# Altium project mLRS_RX.PrjPcb
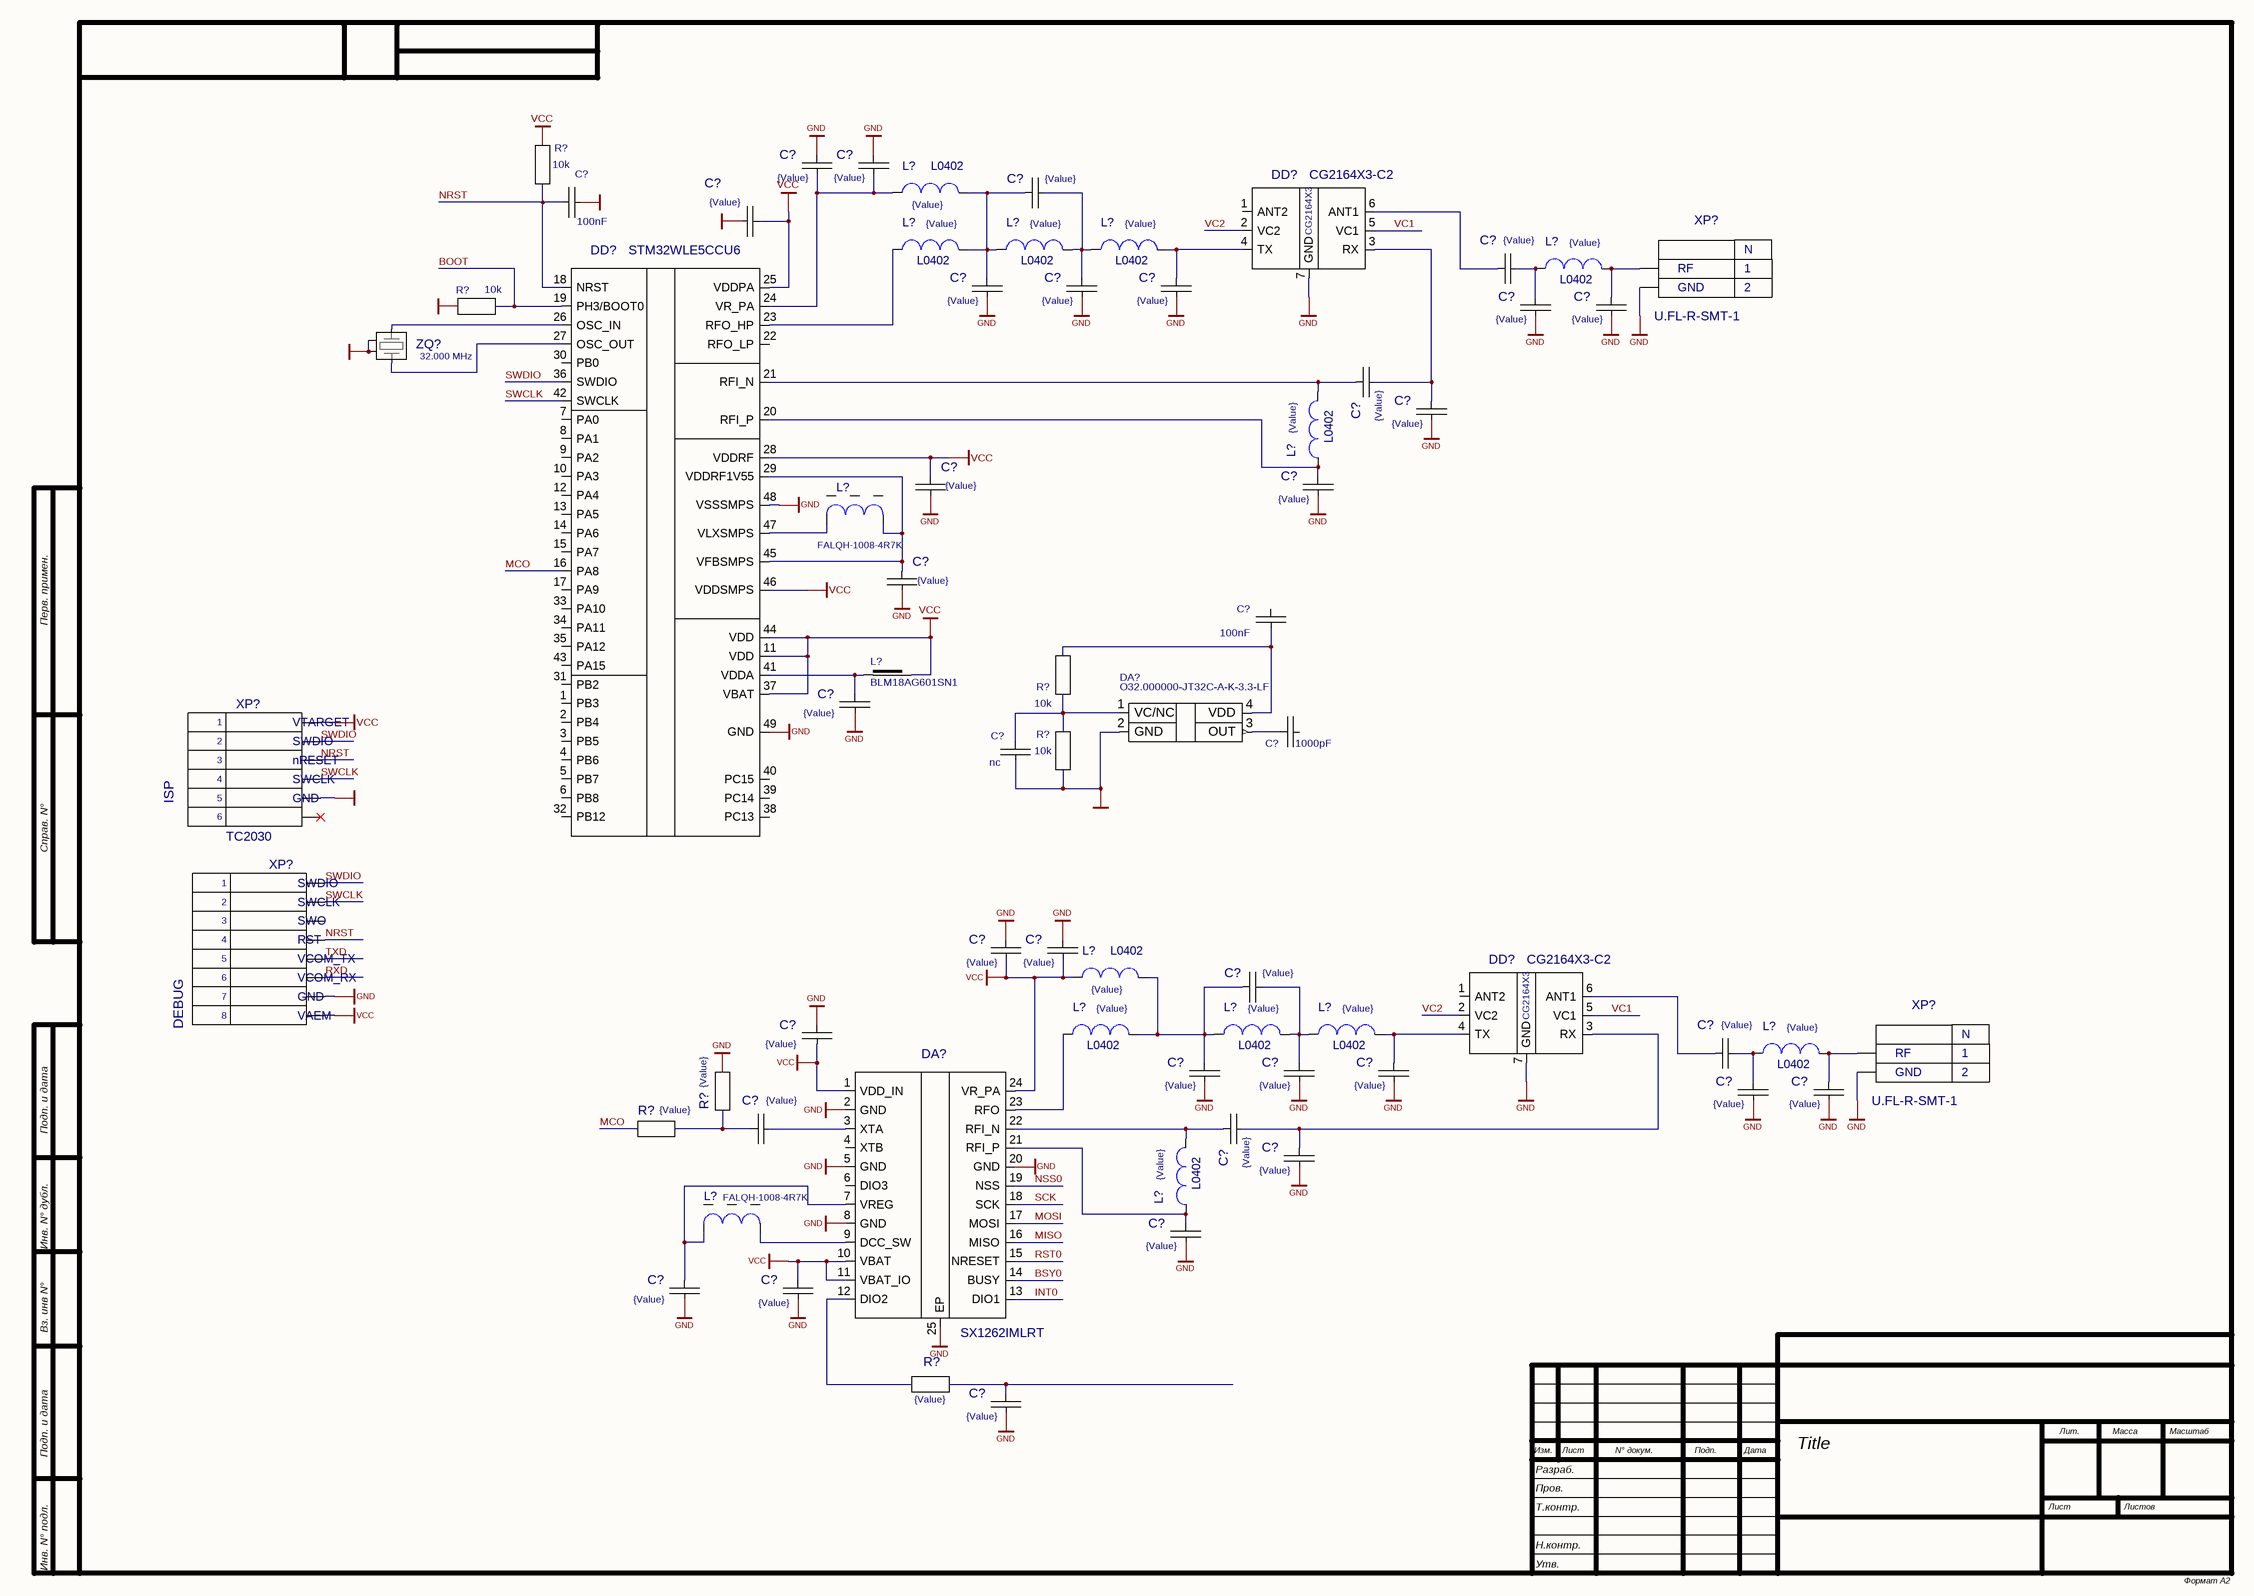
[diagram p0: RX.SchDoc]
1 sheet, 69 parts. Net scope: global (net labels, ports and power ports of the same name join across sheets).

## Sheet RX.SchDoc
size 594 x 420 mm; SheetNumber: 1; SheetTotal: 1; DocumentName: Sheet1.SCHDOC

### Parts
(Parts that share a designator on the sheet are numbered #1, #2 ... from top to bottom, then left to right.)
C?#1  value {Value}  [C0402]  (hidden comment: C0402)
C?#2  value {Value}  [C0402]  (hidden comment: C0402)
C?#3  value {Value}  [C0402]  (hidden comment: C0402)
C?#4  value 100nF  [C0402]  (hidden comment: C0402)
C?#5  value {Value}  [C0603]  (hidden comment: C0603)
C?#6  value {Value}  [C0402]  (hidden comment: C0402)
C?#7  value {Value}  [C0402]  (hidden comment: C0402)
C?#8  value {Value}  [C0402]  (hidden comment: C0402)
C?#9  value {Value}  [C0402]  (hidden comment: C0402)
C?#10  value {Value}  [C0402]  (hidden comment: C0402)
C?#11  value {Value}  [C0402]  (hidden comment: C0402)
C?#12  value {Value}  [C0402]  (hidden comment: C0402)
C?#13  value {Value}  [C0402]  (hidden comment: C0402)
C?#14  value {Value}  [C0603]  (hidden comment: C0603)
C?#15  value {Value}  [C0402]  (hidden comment: C0402)
C?#16  value {Value}  [C0603]  (hidden comment: C0603)
C?#17  value 100nF  [C0402]  (hidden comment: C0402)
C?#18  value {Value}  [C0603]  (hidden comment: C0603)
C?#19  value 1000pF  [C0402]  (hidden comment: C0402)
C?#20  value nc  [C0402]  (hidden comment: C0402)
C?#21  value {Value}  [C0402]  (hidden comment: C0402)
C?#22  value {Value}  [C0402]  (hidden comment: C0402)
C?#23  value {Value}  [C0402]  (hidden comment: C0402)
C?#24  value {Value}  [C0603]  (hidden comment: C0603)
C?#25  value {Value}  [C0402]  (hidden comment: C0402)
C?#26  value {Value}  [C0402]  (hidden comment: C0402)
C?#27  value {Value}  [C0402]  (hidden comment: C0402)
C?#28  value {Value}  [C0402]  (hidden comment: C0402)
C?#29  value {Value}  [C0402]  (hidden comment: C0402)
C?#30  value {Value}  [C0402]  (hidden comment: C0402)
C?#31  value {Value}  [C0402]  (hidden comment: C0402)
C?#32  value {Value}  [C0402]  (hidden comment: C0402)
C?#33  value {Value}  [C0402]  (hidden comment: C0402)
C?#34  value {Value}  [C0402]  (hidden comment: C0402)
C?#35  value {Value}  [C0603]  (hidden comment: C0603)
C?#36  value {Value}  [C0402]  (hidden comment: C0402)
C?#37  value {Value}  [C0402]  (hidden comment: C0402)
DA?#1  O32.000000-JT32C-A-K-3.3-LF  [ZQ_3.2_2.5]
DA?#2  SX1262IMLRT
DD?#1  CG2164X3-C2  [TSON-6]
DD?#2  STM32WLE5CCU6
DD?#3  CG2164X3-C2  [TSON-6]
L?#1  L0402  value {Value}  [L0402]
L?#2  L0402  value {Value}  [L0402]
L?#3  L0402  value {Value}  [L0402]
L?#4  L0402  value {Value}  [L0402]
L?#5  L0402  value {Value}  [L0402]
L?#6  L0402  value {Value}  [L0402]
L?#7  value FALQH-1008-4R7K  [L1206]  (hidden comment: FALQH-1206)
L?#8  BLM18AG601SN1  [L0603]
L?#9  L0402  value {Value}  [L0402]
L?#10  L0402  value {Value}  [L0402]
L?#11  L0402  value {Value}  [L0402]
L?#12  L0402  value {Value}  [L0402]
L?#13  L0402  value {Value}  [L0402]
L?#14  L0402  value {Value}  [L0402]
L?#15  value FALQH-1008-4R7K  [L1206]  (hidden comment: FALQH-1206)
R?#1  value 10k  [R0402]  (hidden comment: R0402)
R?#2  value 10k  [R0402]  (hidden comment: R0402)
R?#3  value 10k  [R0402]  (hidden comment: R0402)
R?#4  value 10k  [R0402]  (hidden comment: R0402)
R?#5  value {Value}  [R0402]  (hidden comment: R0402)
R?#6  value {Value}  [R0402]  (hidden comment: R0402)
R?#7  value {Value}  [R0402]  (hidden comment: R0402)
XP?#1  U.FL-R-SMT-1  [U.FL-R-SMT-1]
XP?#2  TC2030  [TC2030]
XP?#3  PAD_4X2X2.5  [PAD_4X2X2.5]  (value not drawn)
XP?#4  U.FL-R-SMT-1  [U.FL-R-SMT-1]
ZQ?  value 32.000 MHz  [ZQ_3.2_2.5]  (hidden comment: ZQ_SJK-7U)

### Nets
GND: C?#1.1 C?#2.1 C?#4.2 C?#5.2 C?#7.2 C?#8.2 C?#9.2 C?#10.2 C?#11.2 C?#13.2 C?#14.2 C?#15.2 C?#16.2 C?#18.2 C?#20.2 C?#21.1 C?#22.1 C?#24.1 C?#26.2 C?#27.2 C?#28.2 C?#29.2 C?#30.2 C?#33.2 C?#34.2 C?#35.2 C?#36.2 C?#37.2 DA?#1.2(GND) DA?#2.2(GND) DA?#2.5(GND) DA?#2.8(GND) DA?#2.20(GND) DA?#2.25(EP) DD?#1.7(GND) DD?#2.48(VSSSMPS) DD?#2.49(GND) DD?#3.7(GND) R?#2.2 R?#4.2 R?#5.2 XP?#1.2 XP?#2.5 XP?#3.7 XP?#4.2 ZQ?.2 ZQ?.4
VCC: C?#5.1 C?#14.1 C?#21.2 C?#22.2 C?#24.2 C?#36.1 DA?#2.1(VDD_IN) DA?#2.10(VBAT) DA?#2.11(VBAT_IO) DA?#2.24(VR_PA) DD?#2.11(VDD) DD?#2.25(VDDPA) DD?#2.28(VDDRF) DD?#2.37(VBAT) DD?#2.44(VDD) DD?#2.46(VDDSMPS) L?#8.2 L?#9.1 R?#1.2 XP?#2.1 XP?#3.8
BOOT: DD?#2.19(PH3/BOOT0) R?#2.1
BSY0: DA?#2.14(BUSY)
INT0: DA?#2.13(DIO1)
MCO: DD?#2.16(PA8) R?#6.1
MISO: DA?#2.16(MISO)
MOSI: DA?#2.17(MOSI)
NRST: C?#4.1 DD?#2.18(NRST) R?#1.1 XP?#2.3 XP?#3.4
NSS0: DA?#2.19(NSS)
RST0: DA?#2.15(NRESET)
RXD: XP?#3.6
SCK: DA?#2.18(SCK)
SWCLK: DD?#2.42(SWCLK) XP?#2.4 XP?#3.2
SWDIO: DD?#2.36(SWDIO) XP?#2.2 XP?#3.1
TXD: XP?#3.5
VC1: DD?#1.5(VC1) DD?#3.5(VC1)
VC2: DD?#1.2(VC2) DD?#3.2(VC2)
NetC?#1_2: C?#1.2 C?#2.2 DD?#2.24(VR_PA) L?#1.1
NetC?#3_1: C?#3.1 C?#7.1 L?#1.2 L?#2.2 L?#3.1
NetC?#3_2: C?#3.2 C?#8.1 L?#3.2 L?#4.1
NetC?#6_1: C?#6.1 DD?#1.6(ANT1)
NetC?#6_2: C?#6.2 C?#10.1 L?#5.1
NetC?#9_1: C?#9.1 DD?#1.4(TX) L?#4.2
NetC?#11_1: C?#11.1 L?#5.2 XP?#1.1
NetC?#12_1: C?#12.1 DD?#2.21(RFI_N) L?#6.2
NetC?#12_2: C?#12.2 C?#13.1 DD?#1.3(RX)
NetC?#15_1: C?#15.1 DD?#2.20(RFI_P) L?#6.1
NetC?#16_1: C?#16.1 DD?#2.29(VDDRF1V55) DD?#2.45(VFBSMPS) L?#7.2
NetC?#17_2: C?#17.2 DA?#1.4(VDD) R?#3.1
NetC?#18_1: C?#18.1 DD?#2.41(VDDA) L?#8.1
NetC?#19_1: C?#19.1 DA?#1.3(OUT)
NetC?#20_1: C?#20.1 DA?#1.1(VC/NC) R?#3.2 R?#4.1
NetC?#23_1: C?#23.1 C?#26.1 L?#9.2 L?#10.2 L?#11.1
NetC?#23_2: C?#23.2 C?#27.1 L?#11.2 L?#12.1
NetC?#25_1: C?#25.1 DD?#3.6(ANT1)
NetC?#25_2: C?#25.2 C?#29.1 L?#13.1
NetC?#28_1: C?#28.1 DD?#3.4(TX) L?#12.2
NetC?#30_1: C?#30.1 L?#13.2 XP?#4.1
NetC?#31_1: C?#31.1 R?#5.1 R?#6.2
NetC?#31_2: C?#31.2 DA?#2.3(XTA)
NetC?#32_1: C?#32.1 DA?#2.22(RFI_N) L?#14.2
NetC?#32_2: C?#32.2 C?#33.1 DD?#3.3(RX)
NetC?#34_1: C?#34.1 DA?#2.21(RFI_P) L?#14.1
NetC?#35_1: C?#35.1 DA?#2.7(VREG) L?#15.1
NetC?#37_1: C?#37.1 R?#7.2
NetDA?#2_9: DA?#2.9(DCC_SW) L?#15.2
NetDA?#2_12: DA?#2.12(DIO2) R?#7.1
NetDA?#2_23: DA?#2.23(RFO) L?#10.1
NetDD?#2_23: DD?#2.23(RFO_HP) L?#2.1
NetDD?#2_26: DD?#2.26(OSC_IN) ZQ?.1
NetDD?#2_27: DD?#2.27(OSC_OUT) ZQ?.3
NetDD?#2_47: DD?#2.47(VLXSMPS) L?#7.1

Not connected (* = marked no-connect by the designer): C?#17 1; C?#19 2; DA?#2 4(XTB) 6(DIO3); DD?#1 1(ANT2); DD?#2 1(PB3) 2(PB4) 3(PB5) 4(PB6) 5(PB7) 6(PB8) 7(PA0) 8(PA1) 9(PA2) 10(PA3) 12(PA4) 13(PA5) 14(PA6) 15(PA7) 17(PA9) 22(RFO_LP) 30(PB0) 31(PB2) 32(PB12) 33(PA10) 34(PA11) 35(PA12) 38(PC13) 39(PC14) 40(PC15) 43(PA15); DD?#3 1(ANT2); XP?#2 6*; XP?#3 3

### Notes on the sheet
- (near XP?#2) VTARGET
- (near XP?#2) SWDIO
- ISP
- (near XP?#2) SWCLK
- (near XP?#2) nRESET
- (near XP?#2) GND
- (near XP?#3) SWDIO
- (near XP?#3) RST
- (near XP?#3) SWO
- (near XP?#3) SWCLK
- DEBUG
- (near XP?#3) VCOM_RX
- (near XP?#3) VCOM_TX
- (near XP?#3) VAEM
- (near XP?#3) GND
- Title
- Перв. примен.
- Справ. N°
- Подп. и дата
- Инв. N° дубл.
- Вз. инв N°
- Изм.
- Разраб.
- Лист
- N° докум.
- Подп.
- Дата
- Лит.
- Масса
- Масштаб
- Пров.
- Т.контр.
- Листов
- Н.контр.
- Утв.
- Инв. N° подл.
- Формат А2
- (in symbol CG2164X3-C2) CG2164X3
- (in symbol U.FL-R-SMT-1) N; RF; GND

### Library data of the parts
C?#1-C?#4 C?#6-C?#13 C?#15 C?#17 C?#19-C?#23 C?#25-C?#34 C?#36 C?#37 = C0402: Mounting  Method: SMD
C?#5 C?#14 C?#16 C?#18 C?#24 C?#35 = C0603: Mounting  Method: SMD
DA?#1 = TCXO_3225: Mounting  Method: SMD; Value: O32.000000-JT32C-A-K-3.3-LF
DA?#2 = SX1262IMLRT: Value: {Value}; Mounting  Method: SMD
DD?#1 DD?#3 = CG2164X3-C2: Value: {Value}; Mounting  Method: SMD
DD?#2 = STM32WLE5CCU6: Value: {Value}; Mounting  Method: SMD
L?#1-L?#6 L?#9-L?#14 = L0402: Mounting  Method: SMD
L?#7 L?#15 = FALQH-1206: Mounting  Method: SMD
L?#8 = BEAD: Mounting  Method: SMD; Value: BLM18AG601SN1
R?#1-R?#7 = R0402: Mounting  Method: SMD
XP?#1 XP?#4 = U.FL-R-SMT-1: Value: {Value}; Mounting  Method: SMD
XP?#2 = TC2030: Mounting  Method: SMD; Value: *
XP?#3 = PAD_4X2X2.5: Mounting  Method: SMD; Value: *
ZQ? = ZQ_SJK-7U: Mounting  Method: SMD